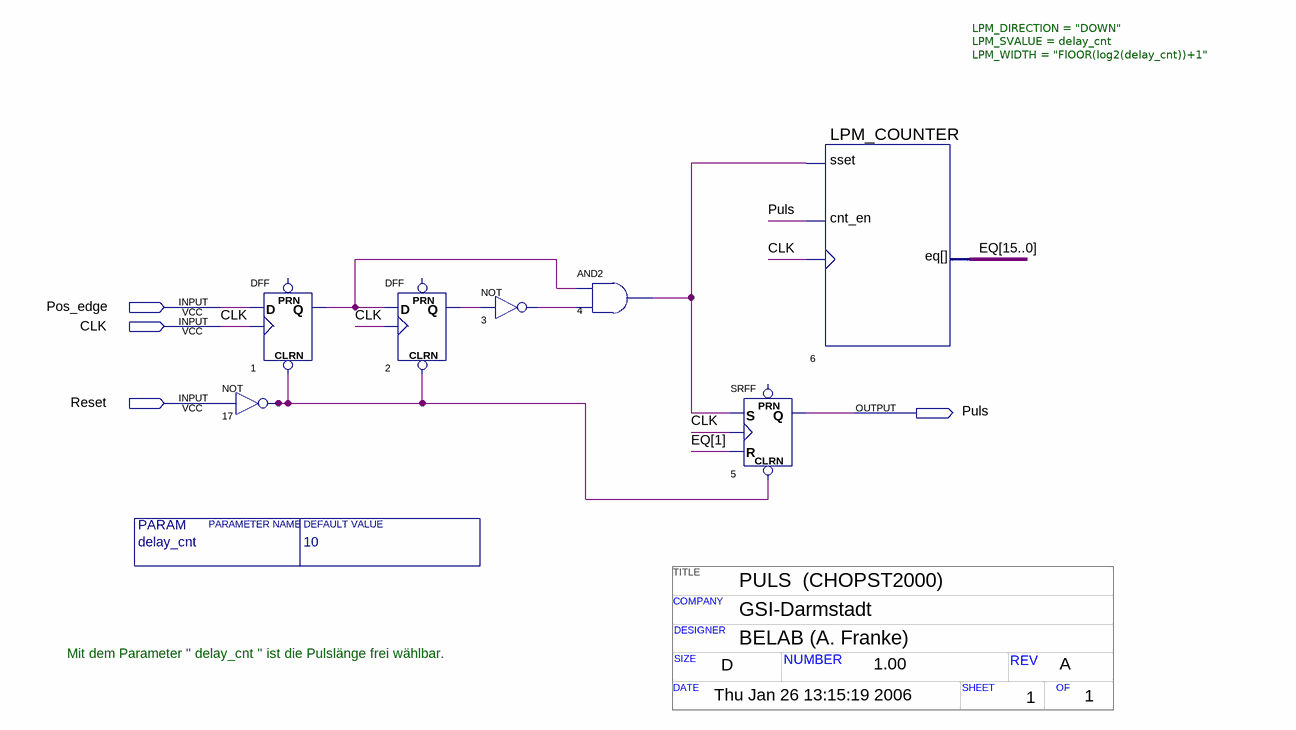
[diagram p0: schematic sheet]
// Quartus schematic puls_ahdl.bdf as structural Verilog: 7 symbols, 4 pins
// Title block: TITLE: PULS  (CHOPST2000); COMPANY: GSI-Darmstadt; DESIGNER: BELAB (A. Franke); SIZE: D; NUMBER: 1.00; REV: A; DATE: Thu Jan 26 13:15:19 2006; SHEET: 1; OF: 1
module puls_ahdl #(parameter delay_cnt = 10) (
  input  Pos_edge,
  input  CLK,
  input  Reset,
  output Puls
);

  wire n1_q, n2_q, n3_out, n4_out, n17_out;
  wire [15:0] EQ;

  DFF u_1 (.CLRN(n17_out), .CLK(CLK), .D(Pos_edge), .Q(n1_q));  // open: PRN
  not u_17 (n17_out, Reset);
  DFF u_2 (.CLRN(n17_out), .CLK(CLK), .D(n1_q), .Q(n2_q));  // open: PRN
  not u_3 (n3_out, n2_q);
  and u_4 (n4_out, n1_q, n3_out);
  SRFF u_5 (.CLRN(n17_out), .S(n4_out), .R(EQ[1]), .CLK(CLK), .Q(Puls));  // open: PRN
  LPM_COUNTER #(.LPM_DIRECTION("DOWN"), .LPM_SVALUE(delay_cnt), .LPM_WIDTH("FlOOR(log2(delay_cnt))+1")) u_6 (
    .sset(n4_out), .cnt_en(Puls), .clock(CLK), .eq(EQ));

  // Notes on the sheet:
  //   Mit dem Parameter " delay_cnt " ist die Pulslänge frei wählbar.
endmodule
